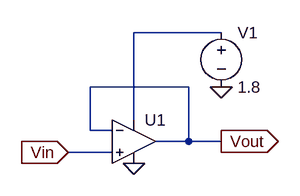
[diagram p0: schematic sourceFollower.asc]
sourceFollower.asc, the LTspice schematic file:
Version 4
SHEET 1 880 680
WIRE 352 -32 224 -32
WIRE 304 48 160 48
WIRE 224 96 224 -32
WIRE 160 112 160 48
WIRE 192 112 160 112
WIRE 304 128 304 48
WIRE 304 128 256 128
WIRE 352 128 304 128
WIRE 192 144 128 144
FLAG 128 144 Vin
IOPIN 128 144 In
FLAG 352 128 Vout
IOPIN 352 128 Out
FLAG 352 48 0
FLAG 224 160 0
SYMBOL OpAmps\\UniversalOpAmp 224 128 R0
SYMATTR InstName U1
SYMATTR Value2 Avol=1Meg GBW=100Meg Vos=0
SYMBOL voltage 352 -48 R0
WINDOW 123 0 0 Left 0
WINDOW 39 0 0 Left 0
SYMATTR InstName V1
SYMATTR Value 1.8

The netlist it stands for:
* sourceFollower.asc
XU1 Vin Vout N001 0 Vout level1 Avol=1Meg GBW=100Meg Vos=0 En=0 Enk=0 In=0 Ink=0 Rin=500Meg  ; pins In+ In- V+ V- OUT
V1 N001 0 1.8
.lib UniversalOpAmp1.lib
.backanno
.end